# Altium schematic sheet sb-sonata-usb.SchDoc: Debug USB & Power In
size Letter; Organization: NewAE Technology Inc.; Address1: 1083 Queen St., Suite 196; Address2: Halifax; Address3: NS; Address4: Canada B3H 0B2; SheetNumber: 2; SheetTotal: 20; SheetApproved: YES
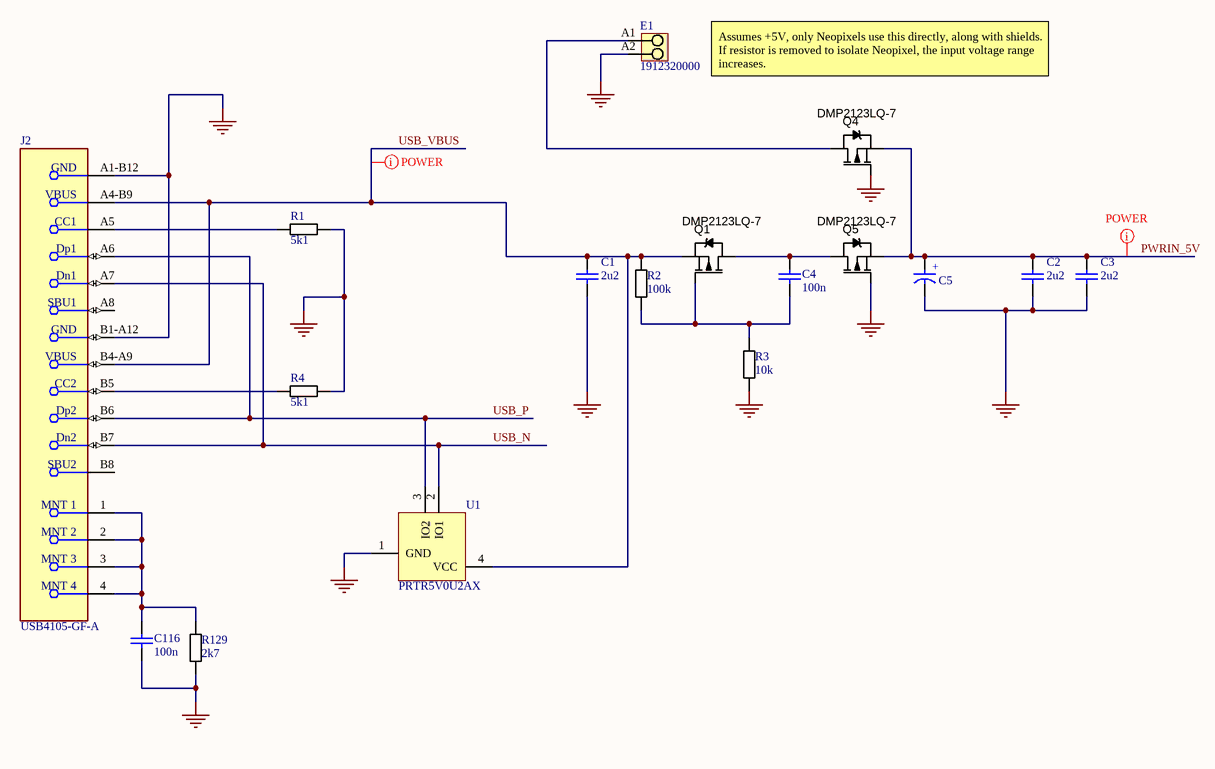
[diagram p0: sb-sonata-usb.SchDoc]

## Parts
C1  2u2  [CAPC0603_M]
C2  2u2  [CAPC0603_M]
C3  2u2  [CAPC0603_M]
C4  100n  [CAPC0402_M]
C5  680uF  [Cap_16v_680uF]  (value not drawn)
C116  100n  [CAPC0402_M]
E1  1912320000  [PS_3_5_90_02]
J2  USB4105-GF-A  [FP-USB4105-GF-A-MFG]
Q1  DMP2123LQ-7  [SOT95P245X110-3M]
Q4  DMP2123LQ-7  [SOT95P245X110-3M]
Q5  DMP2123LQ-7  [SOT95P245X110-3M]
R1  5k1  [RESC1608X55N]
R2  100k  [RESC1005X40N]
R3  10k  [RESC1005X40N]
R4  5k1  [RESC1608X55N]
R129  2k7  [RESC1005X40N]
U1  PRTR5V0U2AX  [SOT143B]

## Nets
GND: C1.2 C2.2 C3.2 C5.2 C116.2 E1.A2 J2.A1-B12(GND) J2.B1-A12(GND) Q4.1(G) Q5.1(G) R1.2 R3.2 R4.2 R129.2 U1.1(GND)
PWRIN_5V: C2.1 C3.1 C5.1 Q4.2(S) Q5.2(S)
USB_N: J2.A7(Dn1) J2.B7(Dn2) U1.2(IO1)
USB_P: J2.A6(Dp1) J2.B6(Dp2) U1.3(IO2)
USB_VBUS: C1.1 J2.A4-B9(VBUS) J2.B4-A9(VBUS) Q1.2(S) R2.1 U1.4(VCC)
NetC4_1: C4.1 Q1.3(D) Q5.3(D)
NetC4_2: C4.2 Q1.1(G) R2.2 R3.1
NetC116_1: C116.1 J2.1(MNT_1) J2.2(MNT_2) J2.3(MNT_3) J2.4(MNT_4) R129.1
NetE1_A1: E1.A1 Q4.3(D)
NetJ2_A5: J2.A5(CC1) R1.1
NetJ2_B5: J2.B5(CC2) R4.1

Not connected (* = marked no-connect by the designer): J2 A8(SBU1) B8(SBU2)

## Layout directives
net class Power: PWRIN_5V, USB_VBUS

## Notes on the sheet
- Assumes +5V, only Neopixels use this directly, along with shields. If resistor is removed to isolate Neopixel, the input voltage range increases.
- Title:
- Date:
- Rev:
- Time:
- Project:
- Sheet
- of
- License:
- Copyright © NewAE Technology Inc.
- Approved:
- NewAE.com
- File:
- (in symbol Cap_16v_680uF) +

## Library data of the parts
C1-C3 = CCHIP-2u2-0603: 2u2, 0603; Manufacture 1: Samsung; Manufacture Part Number 1: CL10B225KP8NNNC; Component Group: Capacitor; Case-EIA: 0603; Case-Metric: 1608; Rated Voltage: 10VDC; Part Number: CCHIP-2u2-0603; Footprint: 0603; Pin Count: 2; Supplier 1: Digi-Key; Supplier Part Number 1: 1276-1134-2-ND; Value: 2u2; Mounting Technology: SMT; Component Kind: Standard; Component Type: Standard
C4 C116 = CCHIP-100n-0402: 100n, 0402; Manufacture Part Number 1: CGA2B3X7R1V104K050BB; Component Group: Capacitor; Case-EIA: 0402; Part Number: CCHIP-100n-0402; Footprint: 0402; Pin Count: 2; Supplier 1: Digi-Key; Supplier Part Number 1: 445-6901-1-ND; Value: 100n; Mounting Technology: SMT; Component Kind: Standard; Component Type: Standard
C5 = Cap_16v_680uF: Aluminum electrolytic 680uF, 8x16mm, radial; Component Group: Capacitor; PP Material Stack: 0; Part Number: Cap_16v_680uF; Pin Count: 2; Value: 680uF; Mounting Technology: Through-hole; Component Kind: Standard; Component Type: Standard; PP Rotation: 0
E1 = CMP-1559-01633-1: OMNIMATE Signal - series PS; Manufacturer: Weidmueller; Mounting_onto_the_PCB: Solder connection; Rated_voltage_for_surge_voltage_class_pollution_degree_II_2: 320 V; UL_94_flammability_rating: V-0; Wire_cross_section_AWG_max_UL_1059: AWG 16; Solid_max_H05_07_V_U: 1,5 mm²; Contact_surface: tinned; Solder_pin_length_mm: 3,5 mm; Solid_min_H05_07_V_U: 0,2 mm²; Side_termination_characteristic: closed side; Rated_current_use_group_B_UL_1059: 10 A; Short_text_for_material: PS 3.50/02/90 3.5SN OR BX; Rated_voltage_use_group_B_UL_1059: 300 V; Pitch_inch: 0,138 inch; Wire_cross_section_AWG_min_UL_1059: AWG 28; Contact_material: Cu-Leg; No_of_poles: 2; Insulating_material: Wemid (PA); Colour: Orange; ComponentLink2Description: URL Link1; PackageReference: PS_3_5_90_02; ComponentLink1URL: http://www.weidmueller.com/; PartNumber: 1912320000; ComponentLink2URL: http://catalog.weidmueller.com/catalog/Start.do?localeId=en&ObjectID=1912320000; Revision: V1; Pitch_mm: 3,5 mm; Qty: 100 PCS; ComponentLink1Description: Manufacturer URL; Packaging: Box
J2 = CMP-245163-000001-1: CONN RCPT USB2.0 TYPEC 5A; Manufacturer: GCT; Voltage Rating: 20V; Is Female: yes; Current Rating: 5/6.25/1.25/0.25A; Number Of Contacts: 16; Conn Orientation: Right Angle; Device Class L1: Connectors; Category: Conn; Lead Free: Yes; RoHS: TRUE; Temperature Range High: +85°C; Digikey Description: CONN RCPT USB2.0 TYPEC 5A; Device Class L3: unset; ComponentLink2Description: Datasheet; Manufacturer Part Number: USB4105-GF-A; Package: 0; Usb Standard: USB 2.0; Device Class L2: USB Connectors; Automotive: No; Temperature Range Low: -40°C; Height: 3.46mm; Temperature: -40°C to +85°C; Contact Material: Gold,Nickel; ComponentLink2URL: https://gct.co/files/drawings/usb4105.pdf; Octopart: https://octopart.com/usb4105-gf-a-gct-106627878
Q1 Q4 Q5 = DMP2123LQ-7: P-Channel, 3A, Logic Level; Manufacture 1: Diodes Inc.; Component Group: MOSFET; Part Number: DMP2123LQ-7; Footprint: SOT23; Manufacture Part Number 1: DMP2123LQ-7; Pin Count: 3; Supplier 1: Digi-Key; Supplier Part Number 1: DMP2123LQ-7DICT-ND; Mounting Technology: SMT; Component Kind: Standard; Component Type: Standard
R1 R4 = RCHIP-5K1-0603: 5k1 res, 0603, 1%, 1/10W; Manufacture 1: Yageo; Manufacture Part Number 1: RC0603FR-075K1L; Component Group: Resistor; Case-EIA: 0603; Case-Metric: 1608; Rated Power: 0.1W; Rated Voltage: 75VDC; Part Number: RCHIP-5K1-0603; Footprint: 0603; Pin Count: 2; Supplier 1: Digi-Key; Supplier Part Number 1: 311-5.10KHRCT-ND; Value: 5k1; Tolerance: 1%; Mounting Technology: SMT; Temperature Range: -55C to 155C; Component Kind: Standard; Component Type: Standard
R2 = RCHIP-100K-0402: 100k res, 0402, 1%, 1/16W; Manufacture 1: Yageo; Manufacture Part Number 1: RC0402FR-07100KL; Component Group: Resistor; Case-EIA: 0402; Case-Metric: 1005; Rated Power: 0.063W; Rated Voltage: 75VDC; Part Number: RCHIP-100K-0402; Footprint: 0402; Pin Count: 2; Supplier 1: Digi-Key; Supplier Part Number 1: 311-100KLRCT-ND; Value: 100k; Tolerance: 1%; Mounting Technology: SMT; Temperature Range: -55C to 155C; Component Kind: Standard; Component Type: Standard
R3 = RCHIP-10K-0402: 10k res, 0402, 1%, 1/16W; Manufacture 1: Yageo; Manufacture Part Number 1: RC0402FR-0710KL; Component Group: Resistor; Case-EIA: 0402; Case-Metric: 1005; Rated Power: 0.063W; Rated Voltage: 75VDC; Part Number: RCHIP-10K-0402; Footprint: 0402; Pin Count: 2; Supplier 1: Digi-Key; Supplier Part Number 1: 311-10.0KLRCT-ND; Value: 10k; Tolerance: 1%; Mounting Technology: SMT; Temperature Range: -55C to 155C; Component Kind: Standard; Component Type: Standard
R129 = RCHIP-2K7-0402: 2k7 res, 0402, 1%, 1/16W; Manufacture 1: Yageo; Manufacture Part Number 1: RC0402FR-072K7L; Component Group: Resistor; Case-EIA: 0402; Case-Metric: 1005; Rated Power: 0.063W; Rated Voltage: 75VDC; Part Number: RCHIP-2K7-0402; Footprint: 0402; Pin Count: 2; Supplier 1: Digi-Key; Supplier Part Number 1: 311-2.70KLRCT-ND; Value: 2k7; Tolerance: 1%; Mounting Technology: SMT; Temperature Range: -55C to 155C; Component Kind: Standard; Component Type: Standard
U1 = PRTR5V0U2AX: USB 2.0 high-speed ESD; Component Group: Diode; Supplier 1: Digi-Key; Supplier Part Number 1: 568-7445-1-ND; Part Number: PRTR5V0U2AX; Pin Count: 4; Component Kind: Standard; Component Type: Standard